# EAGLE design quad_copter_duino (EAGLE 5.10)
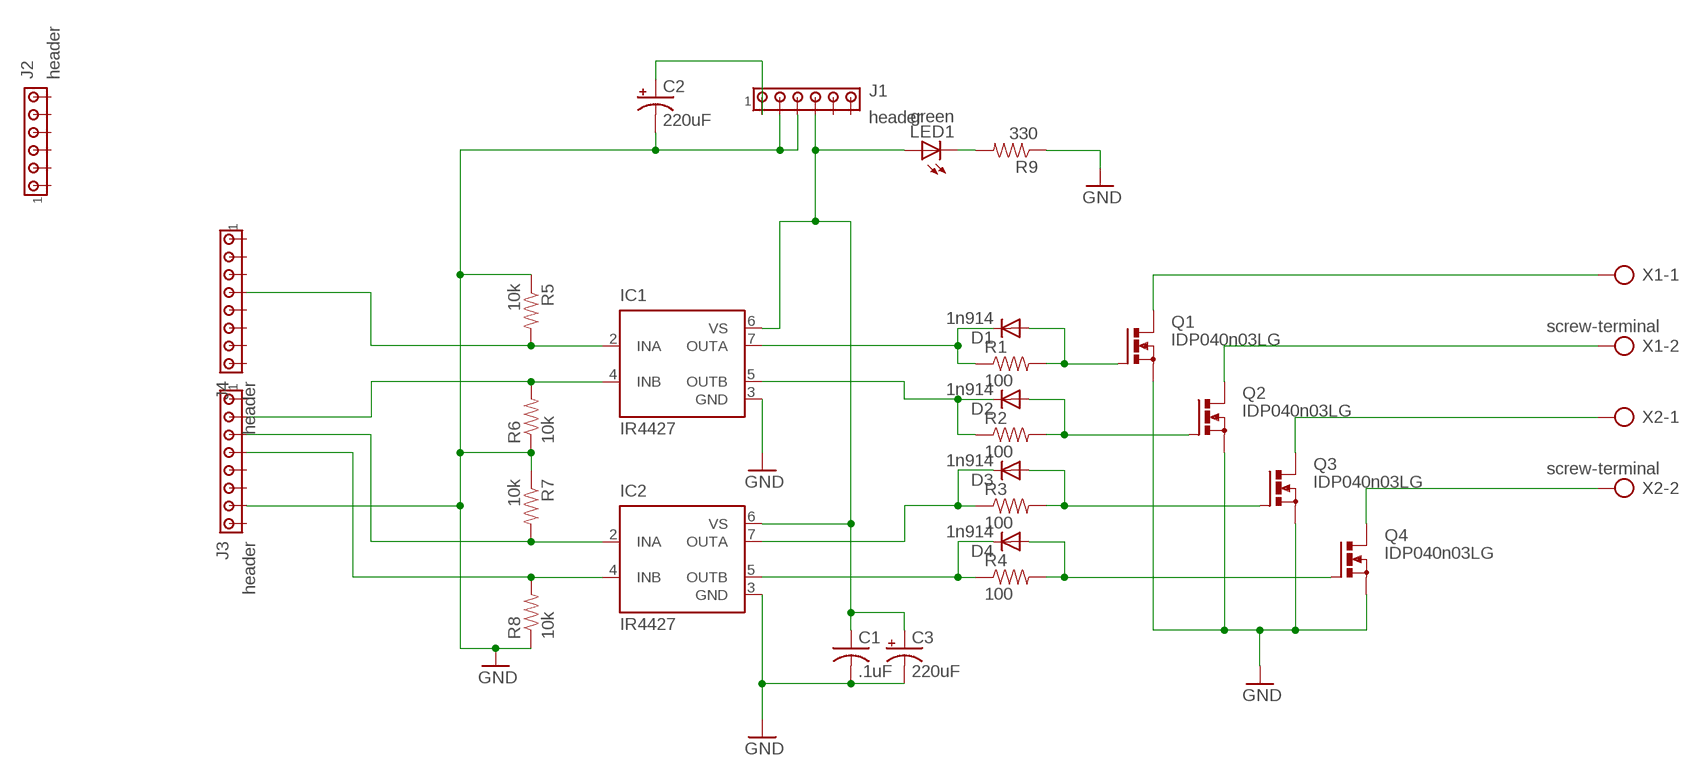
[diagram p0: schematic, sheet 1]

## Parts
C1  .1uF  C-US025-025X050  [C025-025X050]
C2  220uF  CPOL-USE5-10.5  [E5-10,5]
C3  220uF  CPOL-USE5-10.5  [E5-10,5]
D1  1n914  DIODE1N4148  [DIODE-1N4148]
D2  1n914  DIODE1N4148  [DIODE-1N4148]
D3  1n914  DIODE1N4148  [DIODE-1N4148]
D4  1n914  DIODE1N4148  [DIODE-1N4148]
IC1  IR4427  [DIL08]
IC2  IR4427  [DIL08]
J1  header  MTA06-100  [10X06MTA]
J2  header  MTA06-100  [10X06MTA]
J3  header  MTA08-100  [10X08MTA]
J4  header  MTA08-100  [10X08MTA]
LED1  green  LED3MM  [LED3MM]
Q1  IDP040n03LG  PMOSFET_NTO220BV  [TO220BV]
Q2  IDP040n03LG  PMOSFET_NTO220BV  [TO220BV]
Q3  IDP040n03LG  PMOSFET_NTO220BV  [TO220BV]
Q4  IDP040n03LG  PMOSFET_NTO220BV  [TO220BV]
R1  100  RESISTORPTH1  [AXIAL-0.3]
R2  100  RESISTORPTH1  [AXIAL-0.3]
R3  100  RESISTORPTH1  [AXIAL-0.3]
R4  100  RESISTORPTH1  [AXIAL-0.3]
R5  10k  RESISTORPTH-1/6W  [1/6W-RES]
R6  10k  RESISTORPTH-1/6W  [1/6W-RES]
R7  10k  RESISTORPTH-1/6W  [1/6W-RES]
R8  10k  RESISTORPTH-1/6W  [1/6W-RES]
R9  330  RESISTORPTH-1/6W  [1/6W-RES]
X1  screw-terminal  AK500/2  [AK500/2]
X2  screw-terminal  AK500/2  [AK500/2]

## Nets
GND: C1.2 C2.- C3.- IC1.3(GND) IC2.3(GND) J1.4 J1.5 J3.7 Q1.S Q2.S Q3.S Q4.S R5.1 R6.1 R7.1 R8.1 R9.1
N$1: C1.1 C3.+ IC1.6(VS) IC2.6(VS) J1.3 LED1.A
N$2: Q2.D X1.2
N$3: C2.+ J1.6
N$4: Q4.D X2.2
N$5: LED1.K(C) R9.2
N$10: Q3.D X2.1
N$12: Q1.D X1.1
N$13: D1.A Q1.G R1.P$2
N$14: D2.A Q2.G R2.P$2
N$15: D3.A Q3.G R3.P$2
N$16: D4.A Q4.G R4.P$2
N$17: D4.C IC2.5(OUTB) R4.P$1
N$18: D3.C IC2.7(OUTA) R3.P$1
N$19: D2.C IC1.5(OUTB) R2.P$1
N$20: D1.C IC1.7(OUTA) R1.P$1
N$21: IC2.4(INB) J3.4 R8.2
N$22: IC2.2(INA) J3.3 R7.2
N$23: IC1.4(INB) J3.2 R6.2
N$24: IC1.2(INA) J4.4 R5.2
Unconnected: J1.1 J1.2 J2.1 J2.2 J2.3 J2.4 J2.5 J2.6 J3.1 J3.5 J3.6 J3.8 J4.1 J4.2 J4.3 J4.5 J4.6 J4.7 J4.8

## Library data of the parts
C1 = rcl:C-US: CAPACITOR, American symbol
C2 C3 = rcl:CPOL-US: POLARIZED CAPACITOR, American symbol
D1-D4 = SparkFun:DIODE: Diode These are standard reverse protection diodes and small signal diodes. SMA package can handle up to about 1A. SOD-323 can handle about 200mA. What the SOD-323 package when ordering, there are some mfgs out there that are 5-pin packages.
IC1 IC2 = ir:IR4427: DUAL LOW SIDE DRIVER Source: ID4426.pdf
J1 J2 = con-amp:MTA06-100: AMP connector
J3 J4 = con-amp:MTA08-100: AMP connector
LED1 = SparkFun:LED: LEDs Standard schematic elements and footprints for 5mm, 3mm, 1206, and 0603 sized LEDs. 5mm - Spark Fun Electronics SKU : COM-00529 (and others)
Q1-Q4 = transistor-power:PMOSFET_N: Power MOSFET N-Channel
R1-R9 = SparkFun:RESISTOR: Resistor Basic schematic elements and footprints for 0603, 1206, and PTH 1/10th watt (small) resistors.
X1 X2 = con-ptr500:AK500/2: CONNECTOR

## Board
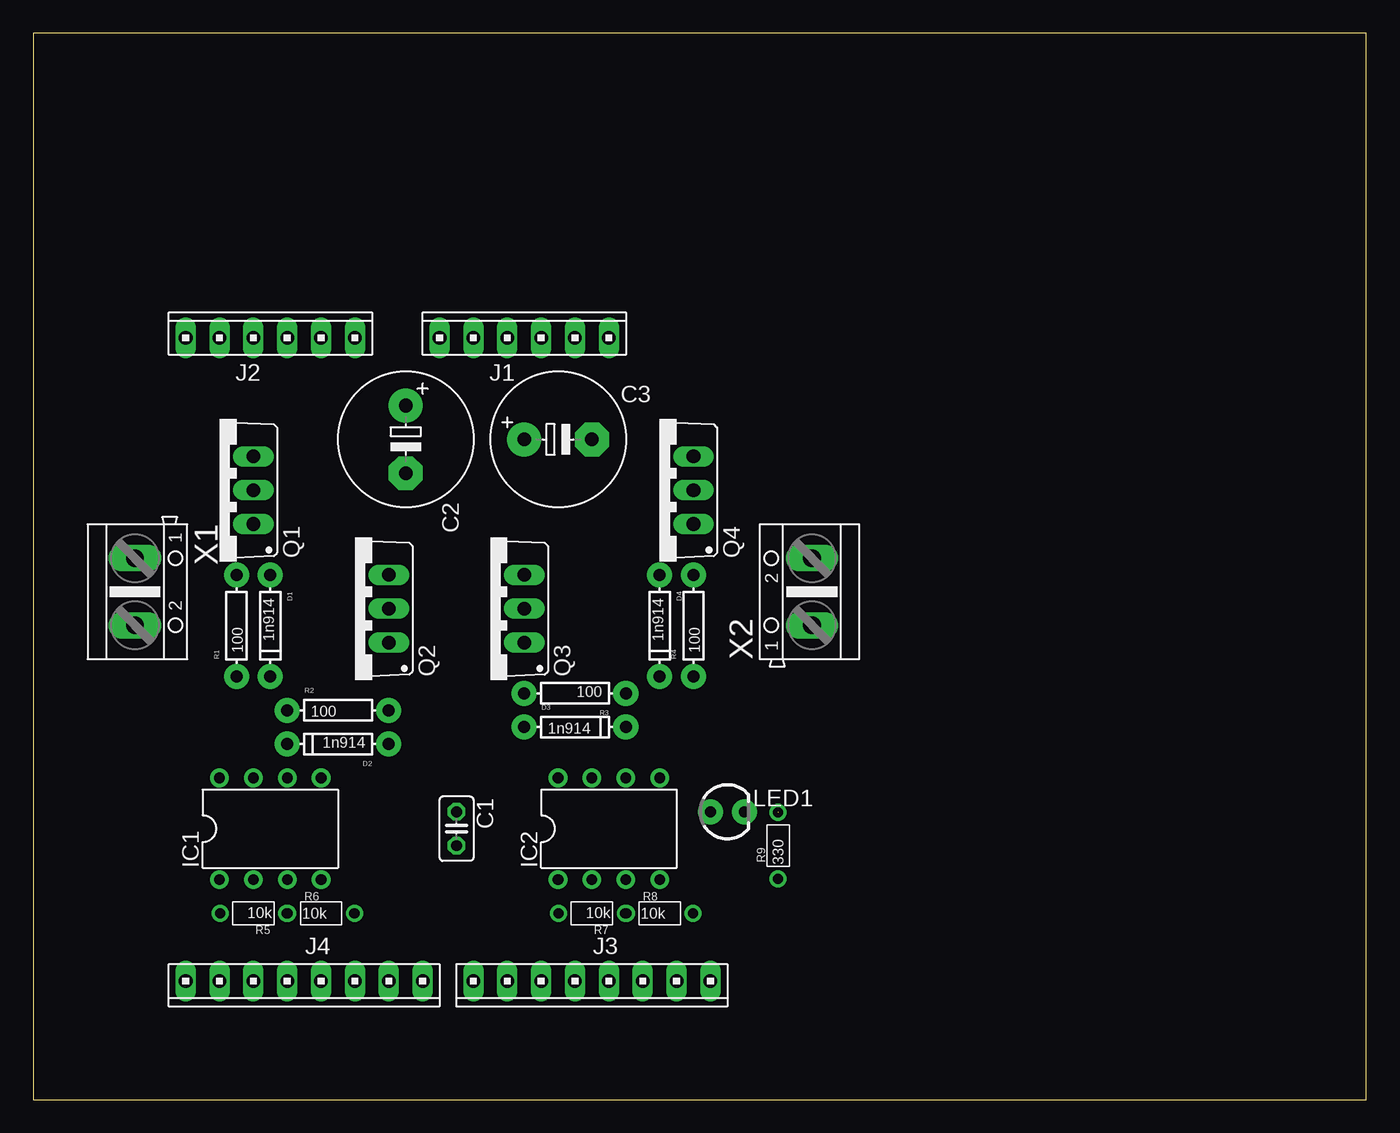
[diagram p1: board, top side]
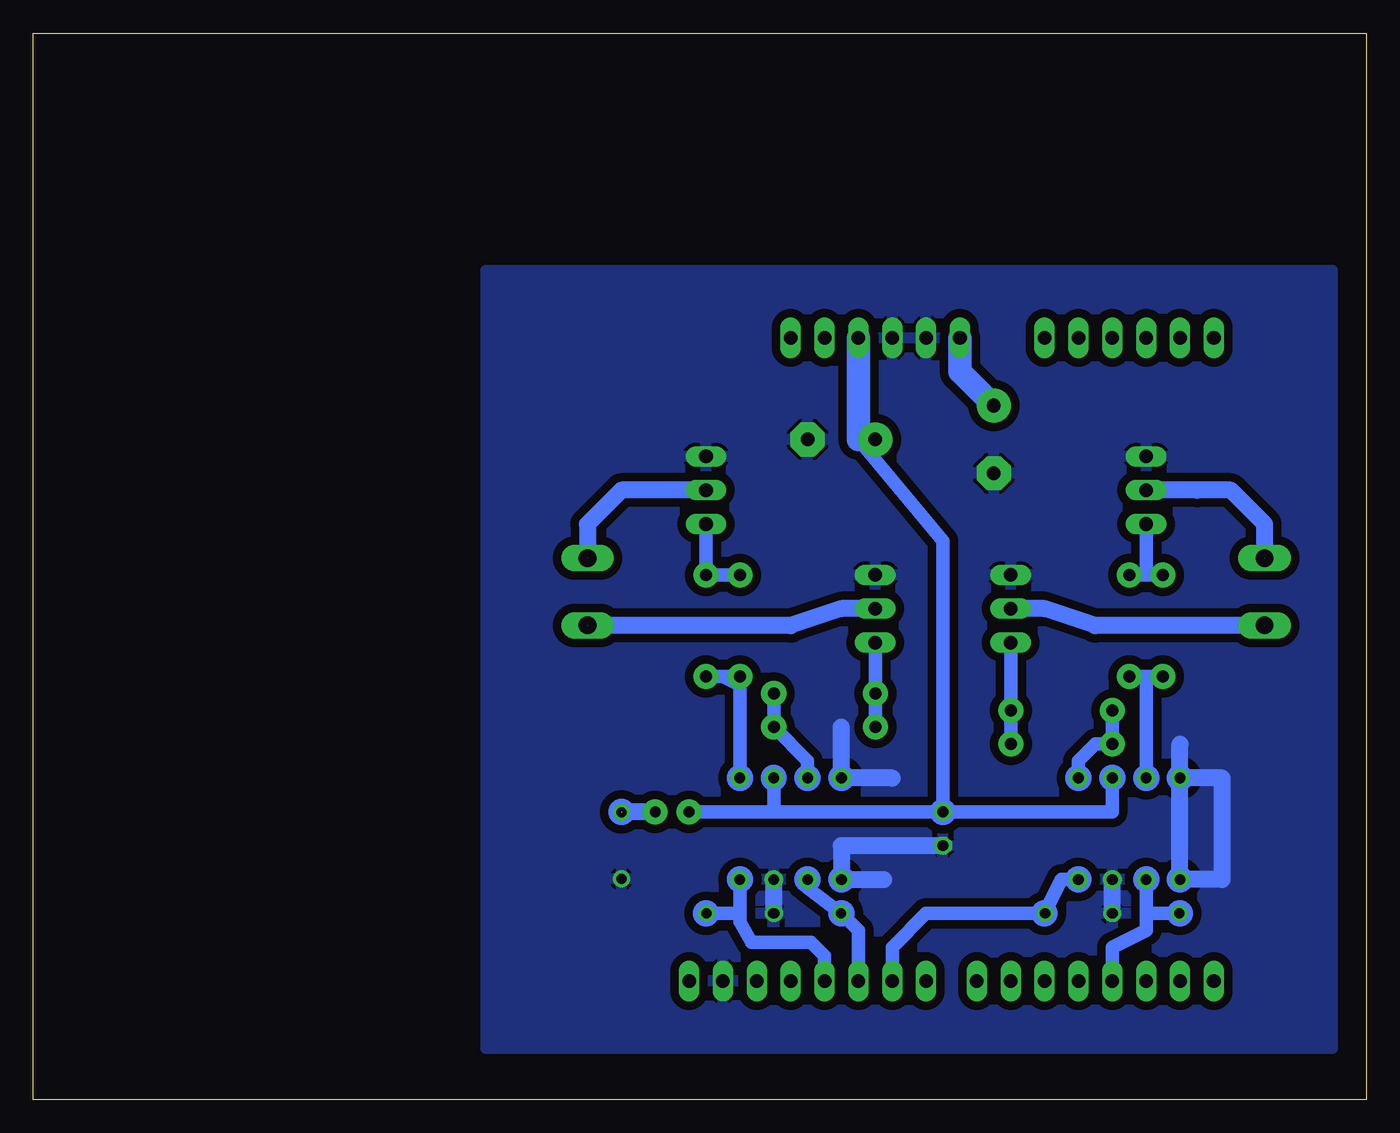
[diagram p2: board, bottom side, seen from below]

Size 100 x 80 mm. Coordinates in mm from the lower left corner, seen from the top.
Outline: 0,0 100,0 100,80 0,80 0,0
Copper layers (1*16): Top 0.035mm / dielectric 1.5mm / Bottom 0.035mm
Design rules "default *": minimum track width 10mil, minimum drill 24mil, track to track 25mil, track to pad 25mil, pad to pad 8mil, via to via 8mil, smd to smd 8mil, copper to edge 40mil, drill to drill 8mil, minimum pad ring 10mil, minimum via ring 8mil, stop-mask expansion 4mil, vias tented up to drill 0mil, thermal gap 10mil

### Footprints (pad centres in the part's own frame; a part is rotated, then mirrored left to right if it is on the bottom)
C025-025X050 = drill 0.813 octagon: 1 -1.27,0; 2 1.27,0
E5-10,5 = drill 1.016 pad 2.54 round: + -2.54,0 | drill 1.016 pad 2.54 octagon: - 2.54,0
DIODE-1N4148 = drill 0.9 pad 1.88 round: A -3.81,0; C 3.81,0
DIL08 = drill 0.8 pad 1.4 round: 1 -3.81,-3.81; 2 -1.27,-3.81; 3 1.27,-3.81; 4 3.81,-3.81; 5 3.81,3.81; 6 1.27,3.81; 7 -1.27,3.81; 8 -3.81,3.81
10X06MTA = drill 1.016 long: 1 6.35,0; 2 3.81,0; 3 1.27,0; 4 -1.27,0; 5 -3.81,0; 6 -6.35,0
10X08MTA = drill 1.016 long: 1 8.89,0; 2 6.35,0; 3 3.81,0; 4 1.27,0; 5 -1.27,0; 6 -3.81,0; 7 -6.35,0; 8 -8.89,0
LED3MM = drill 0.813 pad 1.88 round: A -1.27,0; K 1.27,0
TO220BV = drill 1.016 long: D 0,-2.54; G -2.54,-2.54; S 2.54,-2.54
AXIAL-0.3 = drill 0.9 pad 1.88 round: P$1 -3.81,0; P$2 3.81,0
1/6W-RES = drill 0.762 round: 1 -2.5,0; 2 2.5,0
AK500/2 = drill 1.321 long: 1 -2.515,0; 2 2.515,0

### Placement (x,y rotation side)
C1  31.75,20.32 270 top
C2  27.94,49.53 270 top
C3  39.37,49.53 0 top
D1  17.78,35.56 270 top
D2  22.86,26.67 180 top
D3  40.64,27.94 0 top
D4  46.99,35.56 270 top
IC1  17.78,20.32 0 top
IC2  43.18,20.32 0 top
J1  36.83,57.15 0 top
J2  17.78,57.15 0 top
J3  41.91,8.89 180 top
J4  20.32,8.89 180 top
LED1  52.07,21.59 0 top
Q1  13.97,45.72 90 top
Q2  24.13,36.83 90 top
Q3  34.29,36.83 90 top
Q4  46.99,45.72 90 top
R1  15.24,35.56 90 top
R2  22.86,29.21 0 top
R3  40.64,30.48 180 top
R4  49.53,35.56 90 top
R5  16.51,13.97 180 top
R6  21.59,13.97 0 top
R7  41.91,13.97 180 top
R8  46.99,13.97 0 top
R9  55.88,19.05 90 top
X1  7.62,38.1 270 top
X2  58.42,38.1 90 top

### Tracks (layer width: path | path; a pad name or v marks a point on that pad's centre or on a via)
GND
  Bottom 0.813: IC2.3 44.45,15.24 | IC1.3 19.05,15.24
  Bottom 1.27: 19.05,13.97 IC1.3 | 44.45,13.97 IC2.3 | 13.97,24.13 13.97,26.67 | 13.97,24.13 10.79,24.13 10.79,16.51 13.97,16.51 13.97,24.13 | 36.2,16.51 39.37,16.51 39.37,19.05 C1.2 | 35.56,24.13 39.37,24.13 39.37,27.94
  pour Bottom: 2.54,62.23 2.54,3.81 66.04,3.81 66.04,62.23
N$1
  Bottom 1.016: 44.45,21.59 IC2.6 | C1.1 19.05,21.59 IC1.6 | C1.1 44.45,21.59 | C1.1 31.75,41.91 38.1,49.53 | 44.45,21.59 LED1.A
  Bottom 1.778: C3.+ 38.1,49.53 J1.3
N$2  (1 unrouted)
  Bottom 1.27: 7.62,35.56 20.32,35.56 24.13,36.83 Q2.D
N$3
  Bottom 1.778: C2.+ 30.48,54.61 J1.6
N$4  (1 unrouted)
  Bottom 1.27: 58.42,40.64 58.42,43.18 55.88,45.72 Q4.D
N$5  (1 unrouted)
  Bottom 1.27: LED1.K 55.88,21.59
N$10  (1 unrouted)
  Bottom 1.27: Q3.D 39.37,36.83 43.18,35.56 58.42,35.56
N$12  (1 unrouted)
  Bottom 1.27: Q1.D 12.7,45.72 10.16,45.72 7.62,43.18 7.62,40.64
N$13
  Bottom 1.016: Q1.G 16.51,39.37 D1.A R1.P$2
N$14
  Bottom 1.016: D2.A R2.P$2 Q2.G
N$15
  Bottom 1.016: D3.A R3.P$2 Q3.G
N$16
  Bottom 1.016: D4.A R4.P$2 Q4.G
N$17
  Bottom 1.016: IC2.5 46.99,31.11 48.26,31.75 D4.C R4.P$1
N$18
  Bottom 1.016: R3.P$1 D3.C 41.91,25.4 IC2.7
N$19
  Bottom 1.016: IC1.5 21.59,25.4 20.32,26.67 D2.C R2.P$1
N$20
  Bottom 1.016: IC1.7 16.51,31.75 D1.C R1.P$1
N$21
  Bottom 0.813: R8.2 49.53,13.97
  Bottom 1.016: 46.99,13.97 IC2.4 | 46.99,13.97 R8.2 | J3.4 40.64,10.79 41.66,11.81 46.1,11.81 46.99,13.34 46.99,13.97
N$22
  Bottom 0.813: 39.37,13.97 R7.2
  Bottom 1.016: IC2.2 41.91,15.88 R7.2 | 39.37,13.97 38.1,12.7 J3.3
N$23
  Bottom 1.016: IC1.4 22.86,16.51 24.13,13.97 | 24.13,13.97 R6.2 | 24.13,13.97 33.02,13.97 35.56,11.43 J3.2
N$24
  Bottom 0.813: R5.2 13.97,13.97
  Bottom 1.016: 16.51,13.97 IC1.2 | 16.51,13.97 R5.2 | J4.4 19.05,11.43 16.51,12.7 16.51,13.97
(copper drawn outside any net)
  shapes: Bottom circle x20